# Altium schematic sheet debug.SchDoc: DBG
size A4; Date: 10.11.2025; CheckedBy: BCY; DrawnBy: miaow; DocumentNumber: 11; Revision: v0.0.1; SheetNumber: 11; SheetTotal: 12; Sample: A0; Url: github.com/miaow-cn/pcb-lib; Liscense: GPLv3; Board: MIAOW FOC BOARD; BoardType: MAIN_PCB; Desc: debug board interface
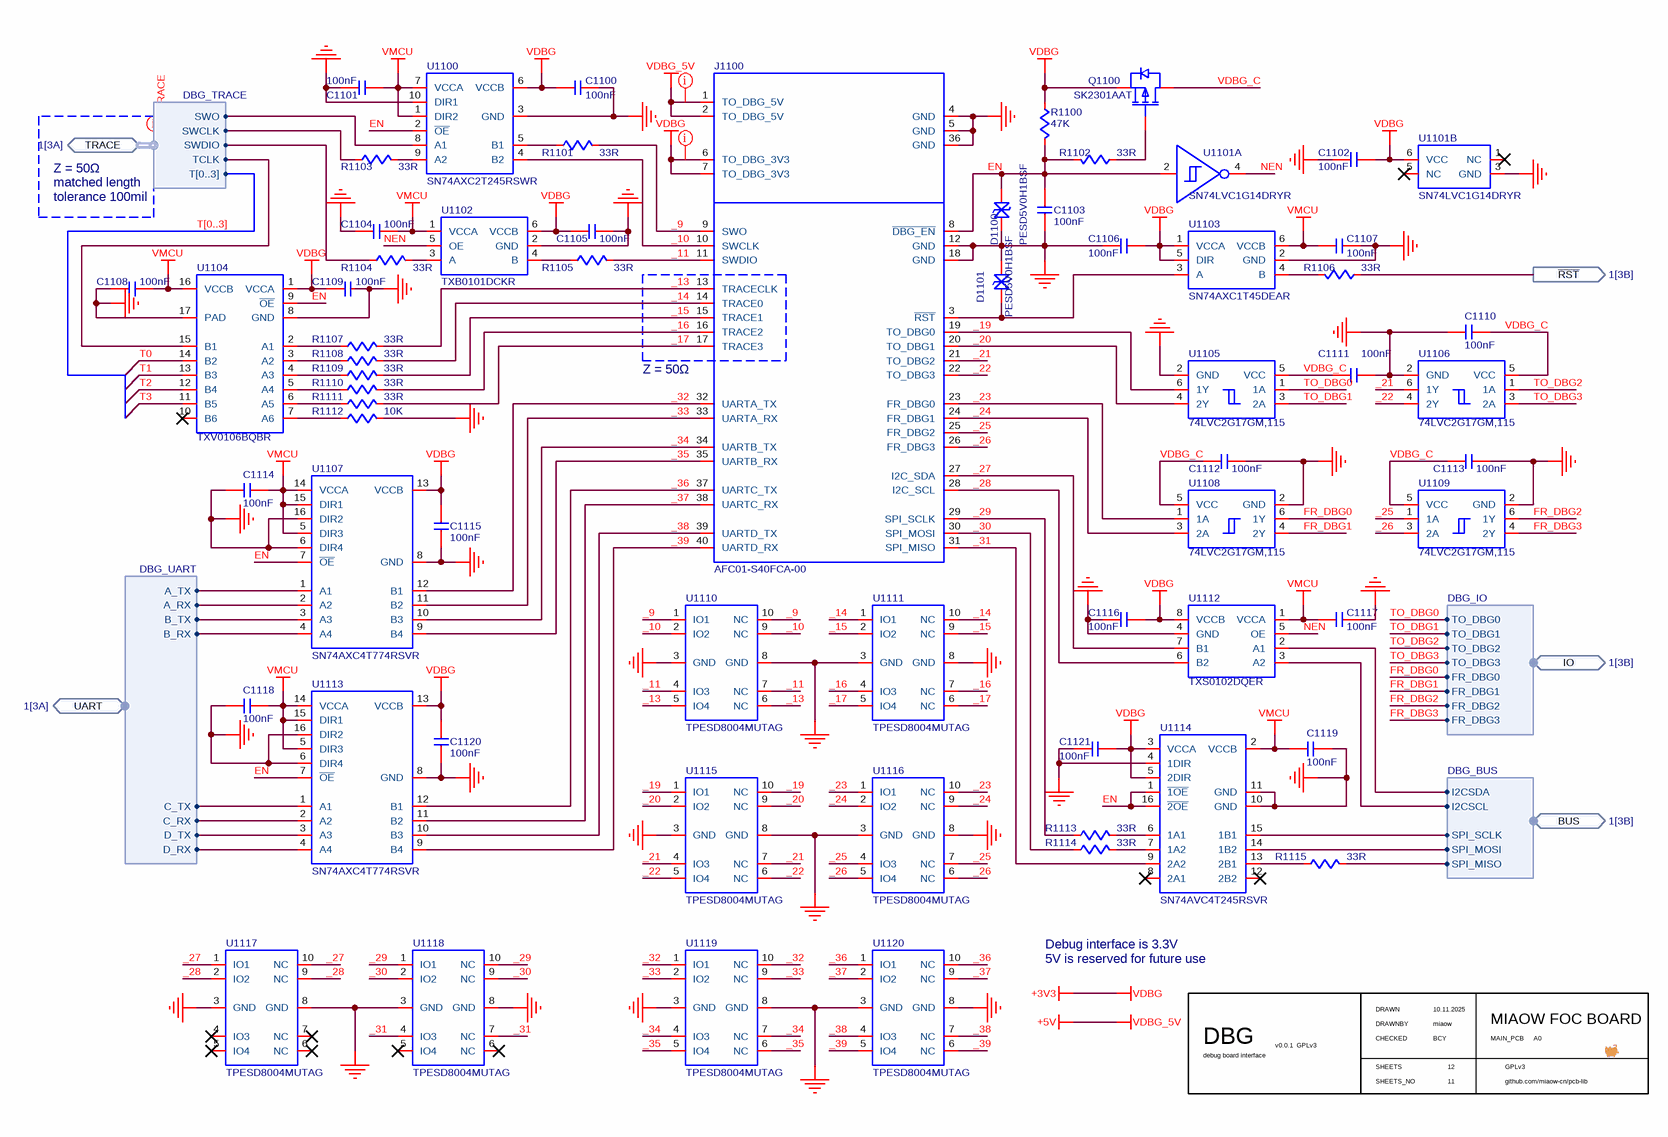
[diagram p0: debug.SchDoc]

## Parts
C1100  value 100nF  [C0402]  (hidden comment: C-NOMO)
C1101  value 100nF  [C0402]  (hidden comment: C-NOMO)
C1102  value 100nF  [C0402]  (hidden comment: C-NOMO)
C1103  value 100nF  [C0402]  (hidden comment: C-NOMO)
C1104  value 100nF  [C0402]  (hidden comment: C-NOMO)
C1105  value 100nF  [C0402]  (hidden comment: C-NOMO)
C1106  value 100nF  [C0402]  (hidden comment: C-NOMO)
C1107  value 100nF  [C0402]  (hidden comment: C-NOMO)
C1108  value 100nF  [C0402]  (hidden comment: C-NOMO)
C1109  value 100nF  [C0402]  (hidden comment: C-NOMO)
C1110  value 100nF  [C0402]  (hidden comment: C-NOMO)
C1111  value 100nF  [C0402]  (hidden comment: C-NOMO)
C1112  value 100nF  [C0402]  (hidden comment: C-NOMO)
C1113  value 100nF  [C0402]  (hidden comment: C-NOMO)
C1114  value 100nF  [C0402]  (hidden comment: C-NOMO)
C1115  value 100nF  [C0402]  (hidden comment: C-NOMO)
C1116  value 100nF  [C0402]  (hidden comment: C-NOMO)
C1117  value 100nF  [C0402]  (hidden comment: C-NOMO)
C1118  value 100nF  [C0402]  (hidden comment: C-NOMO)
C1119  value 100nF  [C0402]  (hidden comment: C-NOMO)
C1120  value 100nF  [C0402]  (hidden comment: C-NOMO)
C1121  value 100nF  [C0402]  (hidden comment: C-NOMO)
D1100  PESD5V0H1BSF  [PESD5V0H1BSF]
D1101  PESD5V0H1BSF  [PESD5V0H1BSF]
J1100  AFC01-S40FCA-00  [AFC01-S40FCA-00]
Q1100  SK2301AAT  [SK2301AAT]
R1100  value 47K  [R0402]  (hidden comment: R)
R1101  value 33R  [R0402]  (hidden comment: R)
R1102  value 33R  [R0402]  (hidden comment: R)
R1103  value 33R  [R0402]  (hidden comment: R)
R1104  value 33R  [R0402]  (hidden comment: R)
R1105  value 33R  [R0402]  (hidden comment: R)
R1106  value 33R  [R0402]  (hidden comment: R)
R1107  value 33R  [R0402]  (hidden comment: R)
R1108  value 33R  [R0402]  (hidden comment: R)
R1109  value 33R  [R0402]  (hidden comment: R)
R1110  value 33R  [R0402]  (hidden comment: R)
R1111  value 33R  [R0402]  (hidden comment: R)
R1112  value 10K  [R0402]  (hidden comment: R)
R1113  value 33R  [R0402]  (hidden comment: R)
R1114  value 33R  [R0402]  (hidden comment: R)
R1115  value 33R  [R0402]  (hidden comment: R)
U1100  SN74AXC2T245RSWR  [SN74AXC2T245RSWR]
U1101  SN74LVC1G14DRYR  [SN74LVC1G14DRYR]  (parts A,B of 2)
U1102  TXB0101DCKR  [TXB0101DCKR]
U1103  SN74AXC1T45DEAR  [SN74AXC1T45DEAR]
U1104  TXV0106BQBR  [TXV0106BQBR]
U1105  74LVC2G17GM,115  [74LVC2G17GM,115]
U1106  74LVC2G17GM,115  [74LVC2G17GM,115]
U1107  SN74AXC4T774RSVR  [SN74AXC4T774RSVR]
U1108  74LVC2G17GM,115  [74LVC2G17GM,115]
U1109  74LVC2G17GM,115  [74LVC2G17GM,115]
U1110  TPESD8004MUTAG  [TPESD8004MUTAG]
U1111  TPESD8004MUTAG  [TPESD8004MUTAG]
U1112  TXS0102DQER  [TXS0102DQER]
U1113  SN74AXC4T774RSVR  [SN74AXC4T774RSVR]
U1114  SN74AVC4T245RSVR  [SN74AVC4T245RSVR]
U1115  TPESD8004MUTAG  [TPESD8004MUTAG]
U1116  TPESD8004MUTAG  [TPESD8004MUTAG]
U1117  TPESD8004MUTAG  [TPESD8004MUTAG]
U1118  TPESD8004MUTAG  [TPESD8004MUTAG]
U1119  TPESD8004MUTAG  [TPESD8004MUTAG]
U1120  TPESD8004MUTAG  [TPESD8004MUTAG]

## Ports
BUS (bidir, harness DBG_BUS, see 1[3B]), IO (bidir, harness DBG_IO, see 1[3B]), TRACE (bidir, harness DBG_TRACE, see 1[3A]), UART (bidir, harness DBG_UART, see 1[3A]), ~{RST} (out, see 1[3B])

## Harnesses
DBG_UART: A_TX, A_RX, B_TX, B_RX, C_TX, C_RX, D_TX, D_RX
DBG_TRACE: SWO, SWCLK, SWDIO, TCLK, T[0..3]
DBG_BUS: I2CSDA, I2CSCL, SPI_MISO, SPI_MOSI, SPI_SCLK
DBG_IO: TO_DBG0, TO_DBG1, FR_DBG0, TO_DBG3, TO_DBG2, FR_DBG1, FR_DBG2, FR_DBG3

## Nets
+3V3: C1100.2 C1102.2 C1105.1 C1106.2 C1109.1 C1115.2 C1116.2 C1120.2 C1121.2 J1100.6(TO_DBG_3V3) J1100.7(TO_DBG_3V3) Q1100.S R1100.1 U1100.6(VCCB) U1101.6(VCC) U1102.6(VCCB) U1103.1(VCCA) U1103.5(DIR) U1104.1(VCCA) U1107.13(VCCB) U1112.8(VCCB) U1113.13(VCCB) U1114.3(VCCA) U1114.5(2DIR)  [also labelled VDBG]
+5V: J1100.1(TO_DBG_5V) J1100.2(TO_DBG_5V)  [also labelled VDBG_5V]
GND: C1100.1 C1101.2 C1102.1 C1103.2 C1104.1 C1105.2 C1106.1 C1107.2 C1108.2 C1109.2 C1110.1 C1111.2 C1112.1 C1113.1 C1114.2 C1115.1 C1116.1 C1117.2 C1118.2 C1119.2 C1120.1 C1121.1 D1100.1 D1101.2 J1100.4(GND) J1100.5(GND) J1100.12(GND) J1100.18(GND) J1100.36(GND) R1112.2 U1100.3(GND) U1100.10(DIR1) U1101.3(GND) U1102.2(GND) U1103.2(GND) U1104.8(GND) U1104.17(PAD) U1105.2(GND) U1106.2(GND) U1107.6(DIR4) U1107.8(GND) U1107.16(DIR2) U1108.2(GND) U1109.2(GND) U1110.3(GND) U1110.8(GND) U1111.3(GND) U1111.8(GND) U1112.4(GND) U1113.6(DIR4) U1113.8(GND) U1113.16(DIR2) U1114.4(1DIR) U1114.10(GND) U1114.11(GND) U1115.3(GND) U1115.8(GND) U1116.3(GND) U1116.8(GND) U1117.3(GND) U1117.8(GND) U1118.3(GND) U1118.8(GND) U1119.3(GND) U1119.8(GND) U1120.3(GND) U1120.8(GND)
VMCU: C1101.1 C1104.2 C1107.1 C1108.1 C1114.1 C1117.1 C1118.1 C1119.1 U1100.1(DIR2) U1100.7(VCCA) U1102.1(VCCA) U1103.6(VCCB) U1104.16(VCCB) U1107.5(DIR3) U1107.14(VCCA) U1107.15(DIR1) U1112.1(VCCA) U1113.5(DIR3) U1113.14(VCCA) U1113.15(DIR1) U1114.2(VCCB)
_9: J1100.9(SWO) R1101.2 U1110.1(IO1) U1110.10(NC)
_10: J1100.10(SWCLK) U1100.4(B2) U1110.2(IO2) U1110.9(NC)
_11: J1100.11(SWDIO) R1105.2 U1110.4(IO3) U1110.7(NC)
_13: J1100.13(TRACECLK) R1107.2 U1110.5(IO4) U1110.6(NC)
_14: J1100.14(TRACE0) R1108.2 U1111.1(IO1) U1111.10(NC)
_15: J1100.15(TRACE1) R1109.2 U1111.2(IO2) U1111.9(NC)
_16: J1100.16(TRACE2) R1110.2 U1111.4(IO3) U1111.7(NC)
_17: J1100.17(TRACE3) R1111.2 U1111.5(IO4) U1111.6(NC)
_19: J1100.19(TO_DBG0) U1105.6(1Y) U1115.1(IO1) U1115.10(NC)
_20: J1100.20(TO_DBG1) U1105.4(2Y) U1115.2(IO2) U1115.9(NC)
_21: J1100.21(TO_DBG2) U1106.6(1Y) U1115.4(IO3) U1115.7(NC)
_22: J1100.22(TO_DBG3) U1106.4(2Y) U1115.5(IO4) U1115.6(NC)
_23: J1100.23(FR_DBG0) U1108.1(1A) U1116.1(IO1) U1116.10(NC)
_24: J1100.24(FR_DBG1) U1108.3(2A) U1116.2(IO2) U1116.9(NC)
_25: J1100.25(FR_DBG2) U1109.1(1A) U1116.4(IO3) U1116.7(NC)
_26: J1100.26(FR_DBG3) U1109.3(2A) U1116.5(IO4) U1116.6(NC)
_27: J1100.27(I2C_SDA) U1112.7(B1) U1117.1(IO1) U1117.10(NC)
_28: J1100.28(I2C_SCL) U1112.6(B2) U1117.2(IO2) U1117.9(NC)
_29: J1100.29(SPI_SCLK) R1113.1 U1118.1(IO1) U1118.10(NC)
_30: J1100.30(SPI_MOSI) R1114.1 U1118.2(IO2) U1118.9(NC)
_31: J1100.31(SPI_MISO) U1114.9(2A2) U1118.4(IO3) U1118.7(NC)
_32: J1100.32(UARTA_TX) U1107.12(B1) U1119.1(IO1) U1119.10(NC)
_33: J1100.33(UARTA_RX) U1107.11(B2) U1119.2(IO2) U1119.9(NC)
_34: J1100.34(UARTB_TX) U1107.10(B3) U1119.4(IO3) U1119.7(NC)
_35: J1100.35(UARTB_RX) U1107.9(B4) U1119.5(IO4) U1119.6(NC)
_36: J1100.37(UARTC_TX) U1113.12(B1) U1120.1(IO1) U1120.10(NC)
_37: J1100.38(UARTC_RX) U1113.11(B2) U1120.2(IO2) U1120.9(NC)
_38: J1100.39(UARTD_TX) U1113.10(B3) U1120.4(IO3) U1120.7(NC)
_39: J1100.40(UARTD_RX) U1113.9(B4) U1120.5(IO4) U1120.6(NC)
EN: C1103.1 D1100.2 J1100.8(~{DBG_EN}) R1100.2 R1102.2 U1100.2(~{OE}) U1101.2(A) U1104.9(~{OE}) U1107.7(~{OE}) U1113.7(~{OE}) U1114.1(~{1OE}) U1114.16(~{2OE})
FR_DBG0: U1108.6(1Y) ; port IO.FR_DBG0
FR_DBG1: U1108.4(2Y) ; port IO.FR_DBG1
FR_DBG2: U1109.6(1Y) ; port IO.FR_DBG2
FR_DBG3: U1109.4(2Y) ; port IO.FR_DBG3
NEN: U1101.4(Y) U1102.5(OE) U1112.5(OE)
~{RST}: R1106.1 ; port ~{RST}
T0: U1104.14(B2)
T1: U1104.13(B3)
T2: U1104.12(B4)
T3: U1104.11(B5)
TO_DBG0: U1105.1(1A) ; port IO.TO_DBG0
TO_DBG1: U1105.3(2A) ; port IO.TO_DBG1
TO_DBG2: U1106.1(1A) ; port IO.TO_DBG2
TO_DBG3: U1106.3(2A) ; port IO.TO_DBG3
VDBG_C: C1110.2 C1111.1 C1112.2 C1113.2 Q1100.D U1105.5(VCC) U1106.5(VCC) U1108.5(VCC) U1109.5(VCC)
NetD1101_1: D1101.1 J1100.3(~{RST}) U1103.3(A)
NetQ1100_G: Q1100.G R1102.1
NetR1101_1: R1101.1 U1100.5(B1)
NetR1103_1: R1103.1 ; port TRACE.SWCLK
NetR1103_2: R1103.2 U1100.9(A2)
NetR1104_1: R1104.1 ; port TRACE.SWDIO
NetR1104_2: R1104.2 U1102.3(A)
NetR1105_1: R1105.1 U1102.4(B)
NetR1106_2: R1106.2 U1103.4(B)
NetR1107_1: R1107.1 U1104.2(A1)
NetR1108_1: R1108.1 U1104.3(A2)
NetR1109_1: R1109.1 U1104.4(A3)
NetR1110_1: R1110.1 U1104.5(A4)
NetR1111_1: R1111.1 U1104.6(A5)
NetR1112_1: R1112.1 U1104.7(A6)
NetR1113_2: R1113.2 U1114.6(1A1)
NetR1114_2: R1114.2 U1114.7(1A2)
NetR1115_1: R1115.1 U1114.13(2B1)
NetR1115_2: R1115.2 ; port BUS.SPI_MISO
NetU1100_8: U1100.8(A1) ; port TRACE.SWO
NetU1104_15: U1104.15(B1) ; port TRACE.TCLK
NetU1107_1: U1107.1(A1) ; port UART.A_TX
NetU1107_2: U1107.2(A2) ; port UART.A_RX
NetU1107_3: U1107.3(A3) ; port UART.B_TX
NetU1107_4: U1107.4(A4) ; port UART.B_RX
NetU1112_2: U1112.2(A1) ; port BUS.I2CSDA
NetU1112_3: U1112.3(A2) ; port BUS.I2CSCL
NetU1113_1: U1113.1(A1) ; port UART.C_TX
NetU1113_2: U1113.2(A2) ; port UART.C_RX
NetU1113_3: U1113.3(A3) ; port UART.D_TX
NetU1113_4: U1113.4(A4) ; port UART.D_RX
NetU1114_14: U1114.14(1B2) ; port BUS.SPI_MOSI
NetU1114_15: U1114.15(1B1) ; port BUS.SPI_SCLK

Not connected (* = marked no-connect by the designer): U1101 1(NC)* 5(NC)*; U1104 10(B6)*; U1114 8(2A1)* 12(2B2)*; U1117 4(IO3)* 5(IO4)* 6(NC)* 7(NC)*; U1118 5(IO4)* 6(NC)*

## Buses and harness runs
bus T[0..3]

## Layout directives
net class CLS_PWR: +3V3, +5V
net class CLS_TRACE: (no net found under the mark)

## Notes on the sheet
- Z = 50Ω
  matched length tolerance 100mil
- (near J1100) Z = 50Ω
- Debug interface is 3.3V
  5V is reserved for future use
- DRAWN
- CHECKED
- DRAWNBY
- SHEETS
- SHEETS_NO

## Library data of the parts
C1100-C1121 = C-NOMO: voltage: 25V; precision: 5%
D1100 D1101 = PESD5V0H1BSF: TVS/ESD; Supplier 1: LCSC; Supplier Part Number 1: C477989
J1100 = FPC-DEBUG: FPC; Supplier 1: LCSC; Supplier Part Number 1: C262674
Q1100 = SK2301AAT: PMOS; Supplier 1: LCSC; Supplier Part Number 1: C5334586
R1100-R1115 = R: precision: 1%
U1100 = SN74AXC2T245RSWR: LEVEL SHIFT; Supplier 1: LCSC; Supplier Part Number 1: C1882550
U1101 = SN74LVC1G14DRYR: INVERTER - 1bit schmitt; Supplier 1: LCSC; Supplier Part Number 1: C2878125
U1102 = TXB0101DCKR: LEVEL SHIFT; Supplier 1: LCSC; Supplier Part Number 1: C324081
U1103 = SN74AXC1T45DEAR: LEVEL SHIFT - 1bit, 0.65V - 3.6V, 500Mbps; Supplier 1: LCSC; Supplier Part Number 1: C2677436
U1104 = TXV0106BQBR: LEVEL SHIFT; Supplier 1: LCSC; Supplier Part Number 1: C22414342
U1105 U1106 U1108 U1109 = 74LVC2G17GM,115: SCHMITT - 2bits; Supplier 1: LCSC; Supplier Part Number 1: C548609
U1107 U1113 = SN74AXC4T774RSVR: LEVEL SHIFT - 4bits, 0.65V - 3.6V, 310Mbps; Supplier 1: LCSC; Supplier Part Number 1: C779392
U1110 U1111 U1115-U1120 = TPESD8004MUTAG: TVS/ESD; Supplier 1: LCSC; Supplier Part Number 1: C2827679
U1114 = SN74AVC4T245RSVR: LEVEL SHIFT - 4bits, 2grps, 1.2V - 3.6V, 380Mbps; Supplier 1: LCSC; Supplier Part Number 1: C133244
U1112 = TXS0102DQER: Supplier Part Number 1: C2652935; Supplier 1: LCSC; ComponentLink1Description: Datasheet; ComponentLink1URL: ..\ds\txs0102dqer.pdf